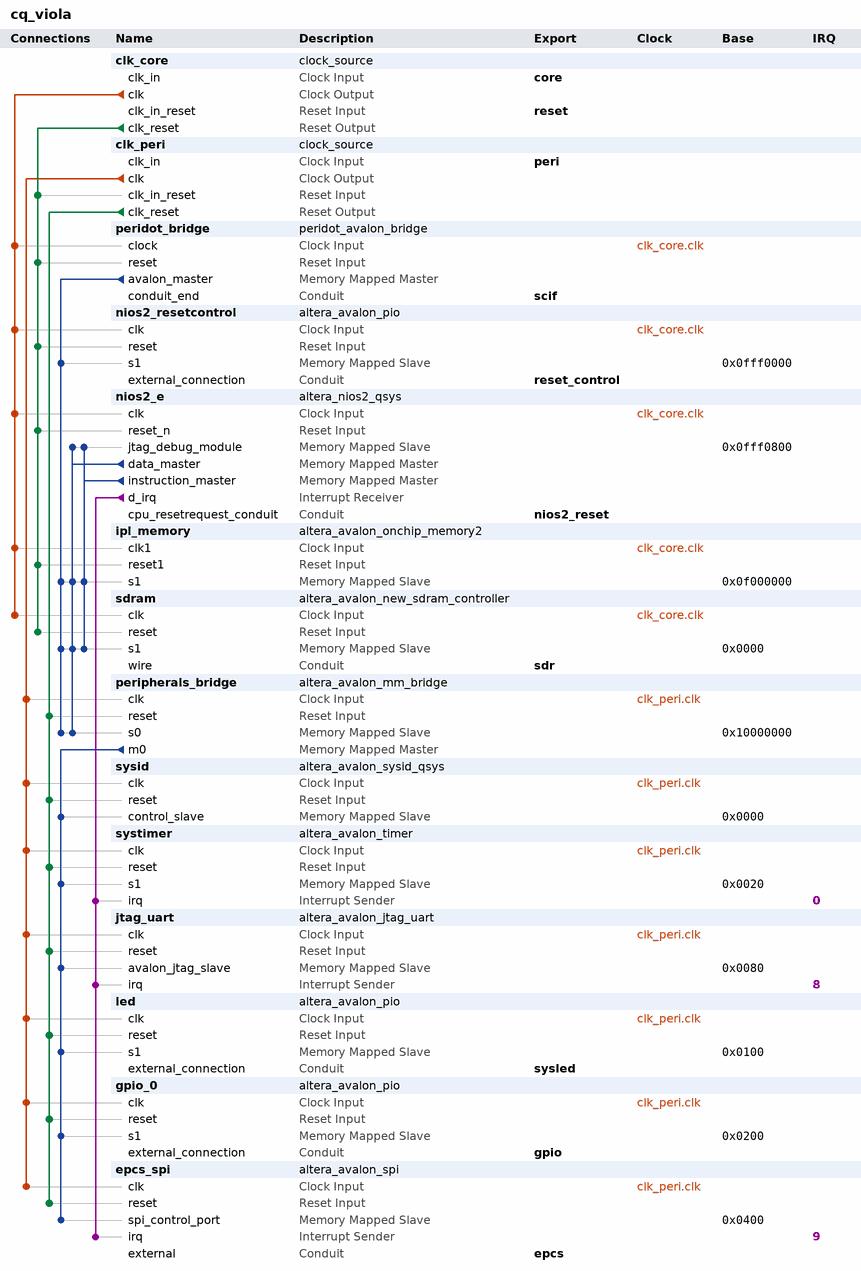
[diagram p0: system contents]
# Platform Designer (Qsys) system cq_viola, Cyclone IV E EP4CE6E22C8
# Parameters at their usual value, and those the tool derives, are not listed.
package require -exact qsys 14.0
create_system cq_viola
set_project_property DEVICE_FAMILY {Cyclone IV E}
set_project_property DEVICE EP4CE6E22C8

add_instance clk_core clock_source 14.0
set_instance_parameter_value clk_core clockFrequency 100000000

add_instance clk_peri clock_source 14.0
set_instance_parameter_value clk_peri clockFrequency 40000000

add_instance peridot_bridge peridot_avalon_bridge 0.9

add_instance nios2_resetcontrol altera_avalon_pio 14.0
set_instance_parameter_value nios2_resetcontrol direction InOut
set_instance_parameter_value nios2_resetcontrol width 1

add_instance nios2_e altera_nios2_qsys 14.0
set_instance_parameter_value nios2_e cpuReset true
set_instance_parameter_value nios2_e resetrequest_enabled true
set_instance_parameter_value nios2_e resetSlave ipl_memory.s1
set_instance_parameter_value nios2_e exceptionSlave ipl_memory.s1
set_instance_parameter_value nios2_e breakSlave nios2_e.jtag_debug_module
set_instance_parameter_value nios2_e impl Tiny
set_instance_parameter_value nios2_e icache_size 4096

add_instance ipl_memory altera_avalon_onchip_memory2 14.0
set_instance_parameter_value ipl_memory allowInSystemMemoryContentEditor true
set_instance_parameter_value ipl_memory dataWidth 32
set_instance_parameter_value ipl_memory dualPort false
set_instance_parameter_value ipl_memory initMemContent true
set_instance_parameter_value ipl_memory initializationFileName ipl_memory_boot
set_instance_parameter_value ipl_memory instanceID IPL
set_instance_parameter_value ipl_memory memorySize 16384
set_instance_parameter_value ipl_memory useNonDefaultInitFile true

add_instance sdram altera_avalon_new_sdram_controller 14.0
set_instance_parameter_value sdram TAC 6.0
set_instance_parameter_value sdram TRCD 21.0
set_instance_parameter_value sdram TRFC 63.0
set_instance_parameter_value sdram TRP 21.0
set_instance_parameter_value sdram casLatency 2
set_instance_parameter_value sdram columnWidth 8
set_instance_parameter_value sdram dataWidth 16
set_instance_parameter_value sdram generateSimulationModel false
set_instance_parameter_value sdram model single_Micron_MT48LC4M32B2_7_chip
set_instance_parameter_value sdram numberOfBanks 4
set_instance_parameter_value sdram numberOfChipSelects 1
set_instance_parameter_value sdram powerUpDelay 200.0
set_instance_parameter_value sdram refreshPeriod 15.625
set_instance_parameter_value sdram rowWidth 12

add_instance peripherals_bridge altera_avalon_mm_bridge 14.0
set_instance_parameter_value peripherals_bridge DATA_WIDTH 32
set_instance_parameter_value peripherals_bridge ADDRESS_WIDTH 16
set_instance_parameter_value peripherals_bridge USE_AUTO_ADDRESS_WIDTH 0
set_instance_parameter_value peripherals_bridge ADDRESS_UNITS SYMBOLS
set_instance_parameter_value peripherals_bridge MAX_PENDING_RESPONSES 1

add_instance sysid altera_avalon_sysid_qsys 14.0
set_instance_parameter_value sysid id -1609299961

add_instance systimer altera_avalon_timer 14.0
set_instance_parameter_value systimer period 1
set_instance_parameter_value systimer periodUnits MSEC

add_instance jtag_uart altera_avalon_jtag_uart 14.0
set_instance_parameter_value jtag_uart simInteractiveOptions INTERACTIVE_ASCII_OUTPUT

add_instance led altera_avalon_pio 14.0
set_instance_parameter_value led direction Output
set_instance_parameter_value led width 1

add_instance gpio_0 altera_avalon_pio 14.0
set_instance_parameter_value gpio_0 direction Bidir
set_instance_parameter_value gpio_0 width 28

add_instance epcs_spi altera_avalon_spi 14.0
set_instance_parameter_value epcs_spi clockPolarity 0
set_instance_parameter_value epcs_spi dataWidth 8
set_instance_parameter_value epcs_spi masterSPI true
set_instance_parameter_value epcs_spi numberOfSlaves 1
set_instance_parameter_value epcs_spi targetClockRate 10000000

# connections
add_connection clk_core.clk ipl_memory.clk1 clock
add_connection clk_core.clk nios2_e.clk clock
add_connection clk_core.clk nios2_resetcontrol.clk clock
add_connection clk_core.clk peridot_bridge.clock clock
add_connection clk_core.clk sdram.clk clock
add_connection clk_peri.clk epcs_spi.clk clock
add_connection clk_peri.clk gpio_0.clk clock
add_connection clk_peri.clk jtag_uart.clk clock
add_connection clk_peri.clk led.clk clock
add_connection clk_peri.clk peripherals_bridge.clk clock
add_connection clk_peri.clk sysid.clk clock
add_connection clk_peri.clk systimer.clk clock
add_connection clk_core.clk_reset clk_peri.clk_in_reset reset
add_connection clk_core.clk_reset ipl_memory.reset1 reset
add_connection clk_core.clk_reset nios2_e.reset_n reset
add_connection clk_core.clk_reset nios2_resetcontrol.reset reset
add_connection clk_core.clk_reset peridot_bridge.reset reset
add_connection clk_core.clk_reset sdram.reset reset
add_connection clk_peri.clk_reset epcs_spi.reset reset
add_connection clk_peri.clk_reset gpio_0.reset reset
add_connection clk_peri.clk_reset jtag_uart.reset reset
add_connection clk_peri.clk_reset led.reset reset
add_connection clk_peri.clk_reset peripherals_bridge.reset reset
add_connection clk_peri.clk_reset sysid.reset reset
add_connection clk_peri.clk_reset systimer.reset reset
add_connection nios2_e.data_master ipl_memory.s1 avalon
set_connection_parameter_value nios2_e.data_master/ipl_memory.s1 baseAddress 0x0f000000
add_connection nios2_e.data_master nios2_e.jtag_debug_module avalon
set_connection_parameter_value nios2_e.data_master/nios2_e.jtag_debug_module baseAddress 0x0fff0800
add_connection nios2_e.data_master peripherals_bridge.s0 avalon
set_connection_parameter_value nios2_e.data_master/peripherals_bridge.s0 baseAddress 0x10000000
add_connection nios2_e.data_master sdram.s1 avalon
set_connection_parameter_value nios2_e.data_master/sdram.s1 baseAddress 0x0000
add_connection nios2_e.instruction_master ipl_memory.s1 avalon
set_connection_parameter_value nios2_e.instruction_master/ipl_memory.s1 baseAddress 0x0f000000
add_connection nios2_e.instruction_master nios2_e.jtag_debug_module avalon
set_connection_parameter_value nios2_e.instruction_master/nios2_e.jtag_debug_module baseAddress 0x0fff0800
add_connection nios2_e.instruction_master sdram.s1 avalon
set_connection_parameter_value nios2_e.instruction_master/sdram.s1 baseAddress 0x0000
add_connection peridot_bridge.avalon_master ipl_memory.s1 avalon
set_connection_parameter_value peridot_bridge.avalon_master/ipl_memory.s1 baseAddress 0x0f000000
add_connection peridot_bridge.avalon_master nios2_resetcontrol.s1 avalon
set_connection_parameter_value peridot_bridge.avalon_master/nios2_resetcontrol.s1 baseAddress 0x0fff0000
add_connection peridot_bridge.avalon_master peripherals_bridge.s0 avalon
set_connection_parameter_value peridot_bridge.avalon_master/peripherals_bridge.s0 baseAddress 0x10000000
add_connection peridot_bridge.avalon_master sdram.s1 avalon
set_connection_parameter_value peridot_bridge.avalon_master/sdram.s1 baseAddress 0x0000
add_connection peripherals_bridge.m0 epcs_spi.spi_control_port avalon
set_connection_parameter_value peripherals_bridge.m0/epcs_spi.spi_control_port baseAddress 0x0400
add_connection peripherals_bridge.m0 gpio_0.s1 avalon
set_connection_parameter_value peripherals_bridge.m0/gpio_0.s1 baseAddress 0x0200
add_connection peripherals_bridge.m0 jtag_uart.avalon_jtag_slave avalon
set_connection_parameter_value peripherals_bridge.m0/jtag_uart.avalon_jtag_slave baseAddress 0x0080
add_connection peripherals_bridge.m0 led.s1 avalon
set_connection_parameter_value peripherals_bridge.m0/led.s1 baseAddress 0x0100
add_connection peripherals_bridge.m0 sysid.control_slave avalon
set_connection_parameter_value peripherals_bridge.m0/sysid.control_slave baseAddress 0x0000
add_connection peripherals_bridge.m0 systimer.s1 avalon
set_connection_parameter_value peripherals_bridge.m0/systimer.s1 baseAddress 0x0020
add_connection nios2_e.d_irq epcs_spi.irq interrupt
set_connection_parameter_value nios2_e.d_irq/epcs_spi.irq irqNumber 9
add_connection nios2_e.d_irq jtag_uart.irq interrupt
set_connection_parameter_value nios2_e.d_irq/jtag_uart.irq irqNumber 8
add_connection nios2_e.d_irq systimer.irq interrupt
set_connection_parameter_value nios2_e.d_irq/systimer.irq irqNumber 0

# exported interfaces
add_interface core clock sink
set_interface_property core EXPORT_OF clk_core.clk_in
add_interface reset reset sink
set_interface_property reset EXPORT_OF clk_core.clk_in_reset
add_interface peri clock sink
set_interface_property peri EXPORT_OF clk_peri.clk_in
add_interface sysled conduit end
set_interface_property sysled EXPORT_OF led.external_connection
add_interface sdr conduit end
set_interface_property sdr EXPORT_OF sdram.wire
add_interface gpio conduit end
set_interface_property gpio EXPORT_OF gpio_0.external_connection
add_interface epcs conduit end
set_interface_property epcs EXPORT_OF epcs_spi.external
add_interface scif conduit end
set_interface_property scif EXPORT_OF peridot_bridge.conduit_end
add_interface nios2_reset conduit end
set_interface_property nios2_reset EXPORT_OF nios2_e.cpu_resetrequest_conduit
add_interface reset_control conduit end
set_interface_property reset_control EXPORT_OF nios2_resetcontrol.external_connection

set_interconnect_requirement {$system} qsys_mm.clockCrossingAdapter HANDSHAKE
set_interconnect_requirement {$system} qsys_mm.maxAdditionalLatency 1

save_system cq_viola.qsys
